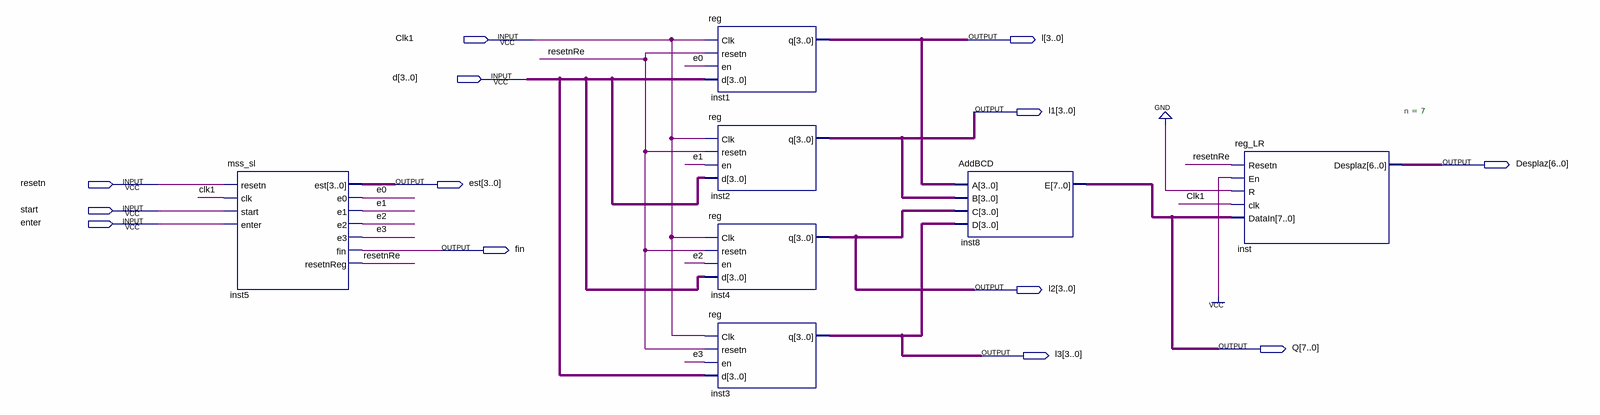
[diagram p0: schematic sheet]
// Quartus schematic Circuito7.bdf as structural Verilog: 7 symbols, 13 pins
module Circuito7 (
  input  Clk1,
  input  [3:0] d,
  input  resetn,
  input  start,
  input  enter,
  output [3:0] l,
  output [3:0] l1,
  output [6:0] Desplaz,
  output [3:0] est,
  output fin,
  output [3:0] l2,
  output [7:0] Q,
  output [3:0] l3
);

  wire e0, e1, e2, e3, resetnRe;

  mss_sl inst5 (
    .resetn(resetn), .clk(Clk1), .start(start), .enter(enter), .est(est), .e0(e0), .e1(e1), .e2(e2), .e3(e3),
    .fin(fin), .resetnReg(resetnRe));
  \reg  inst1 (.Clk(Clk1), .resetn(resetnRe), .en(e0), .d(d), .q(l));
  \reg  inst2 (.Clk(Clk1), .resetn(resetnRe), .en(e1), .d(d), .q(l1));
  \reg  inst4 (.Clk(Clk1), .resetn(resetnRe), .en(e2), .d(d), .q(l2));
  \reg  inst3 (.Clk(Clk1), .resetn(resetnRe), .en(e3), .d(d), .q(l3));
  AddBCD inst8 (.A(l), .B(l1), .C(l2), .D(l3), .E(Q));
  reg_LR #(.n(7)) inst (.Resetn(resetnRe), .En(1'b1), .R(1'b0), .clk(Clk1), .DataIn(Q), .Desplaz(Desplaz));
endmodule
